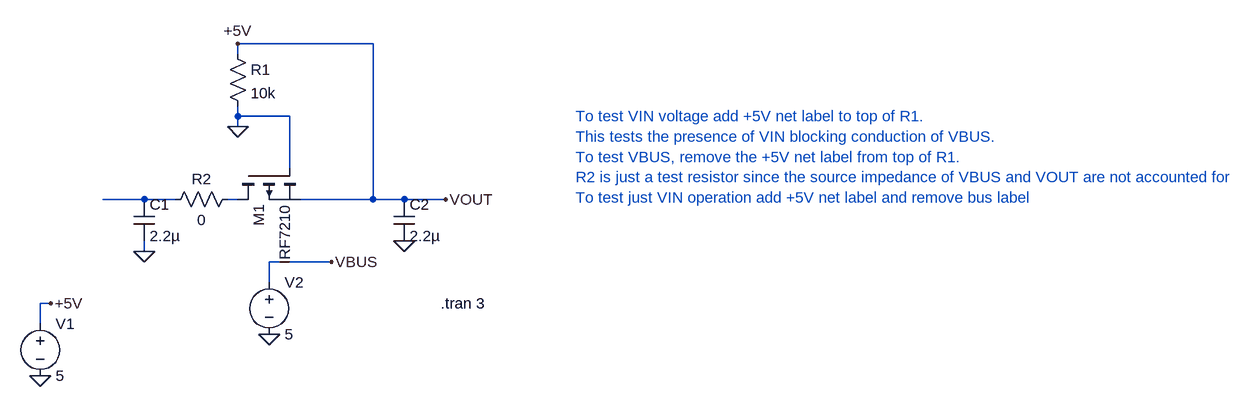
[diagram p0: schematic Power_Switching_Test.asc]
Power_Switching_Test.asc, the LTspice schematic file:
Version 4
SHEET 1 1948 680
WIRE 384 -80 176 -80
WIRE 176 -64 176 -80
WIRE 176 32 176 16
WIRE 256 32 176 32
WIRE 176 48 176 32
WIRE 256 112 256 32
WIRE 32 160 -32 160
WIRE 80 160 32 160
WIRE 176 160 160 160
WIRE 384 160 384 -80
WIRE 384 160 272 160
WIRE 432 160 384 160
WIRE 496 160 432 160
WIRE 32 240 32 224
WIRE 320 256 224 256
WIRE 224 288 224 256
WIRE -112 320 -128 320
WIRE -128 352 -128 320
FLAG -128 432 0
FLAG -112 320 +5V
FLAG 176 48 0
FLAG 32 240 0
FLAG 224 368 0
FLAG 320 256 VBUS
FLAG 432 224 0
FLAG 496 160 VOUT
FLAG 176 -80 +5V
SYMBOL pmos 176 112 M90
SYMATTR InstName M1
SYMATTR Value IRF7210
SYMBOL voltage -128 336 R0
WINDOW 123 0 0 Left 0
WINDOW 39 0 0 Left 0
SYMATTR InstName V1
SYMATTR Value 5
SYMBOL res 160 -80 R0
SYMATTR InstName R1
SYMATTR Value 10k
SYMBOL cap 16 160 R0
SYMATTR InstName C1
SYMATTR Value 2.2µ
SYMBOL voltage 224 272 R0
WINDOW 123 0 0 Left 0
WINDOW 39 0 0 Left 0
SYMATTR InstName V2
SYMATTR Value 5
SYMBOL cap 416 160 R0
SYMATTR InstName C2
SYMATTR Value 2.2µ
SYMBOL res 176 144 R90
WINDOW 0 0 56 VBottom 2
WINDOW 3 32 56 VTop 2
SYMATTR InstName R2
SYMATTR Value 0
TEXT 488 320 Left 2 !.tran 3
TEXT 696 32 Left 2 ;To test VIN voltage add +5V net label to top of R1. \nThis tests the presence of VIN blocking conduction of VBUS.\nTo test VBUS, remove the +5V net label from top of R1.\nR2 is just a test resistor since the source impedance of VBUS and VOUT are not accounted for\nTo test just VIN operation add +5V net label and remove bus label

The netlist it stands for:
* Power_Switching_Test.asc
M1 N002 0 VOUT VOUT IRF7210
V1 VOUT 0 5
R1 VOUT 0 10k
C1 N001 0 2.2µ
V2 VBUS 0 5
C2 VOUT 0 2.2µ
R2 N002 N001 0
.model NMOS NMOS
.model PMOS PMOS
.lib standard.mos
.tran 3
* To test VIN voltage add +5V net label to top of R1.
* This tests the presence of VIN blocking conduction of VBUS.
* To test VBUS, remove the +5V net label from top of R1.
* R2 is just a test resistor since the source impedance of VBUS and VOUT are not accounted for
* To test just VIN operation add +5V net label and remove bus label
.backanno
.end